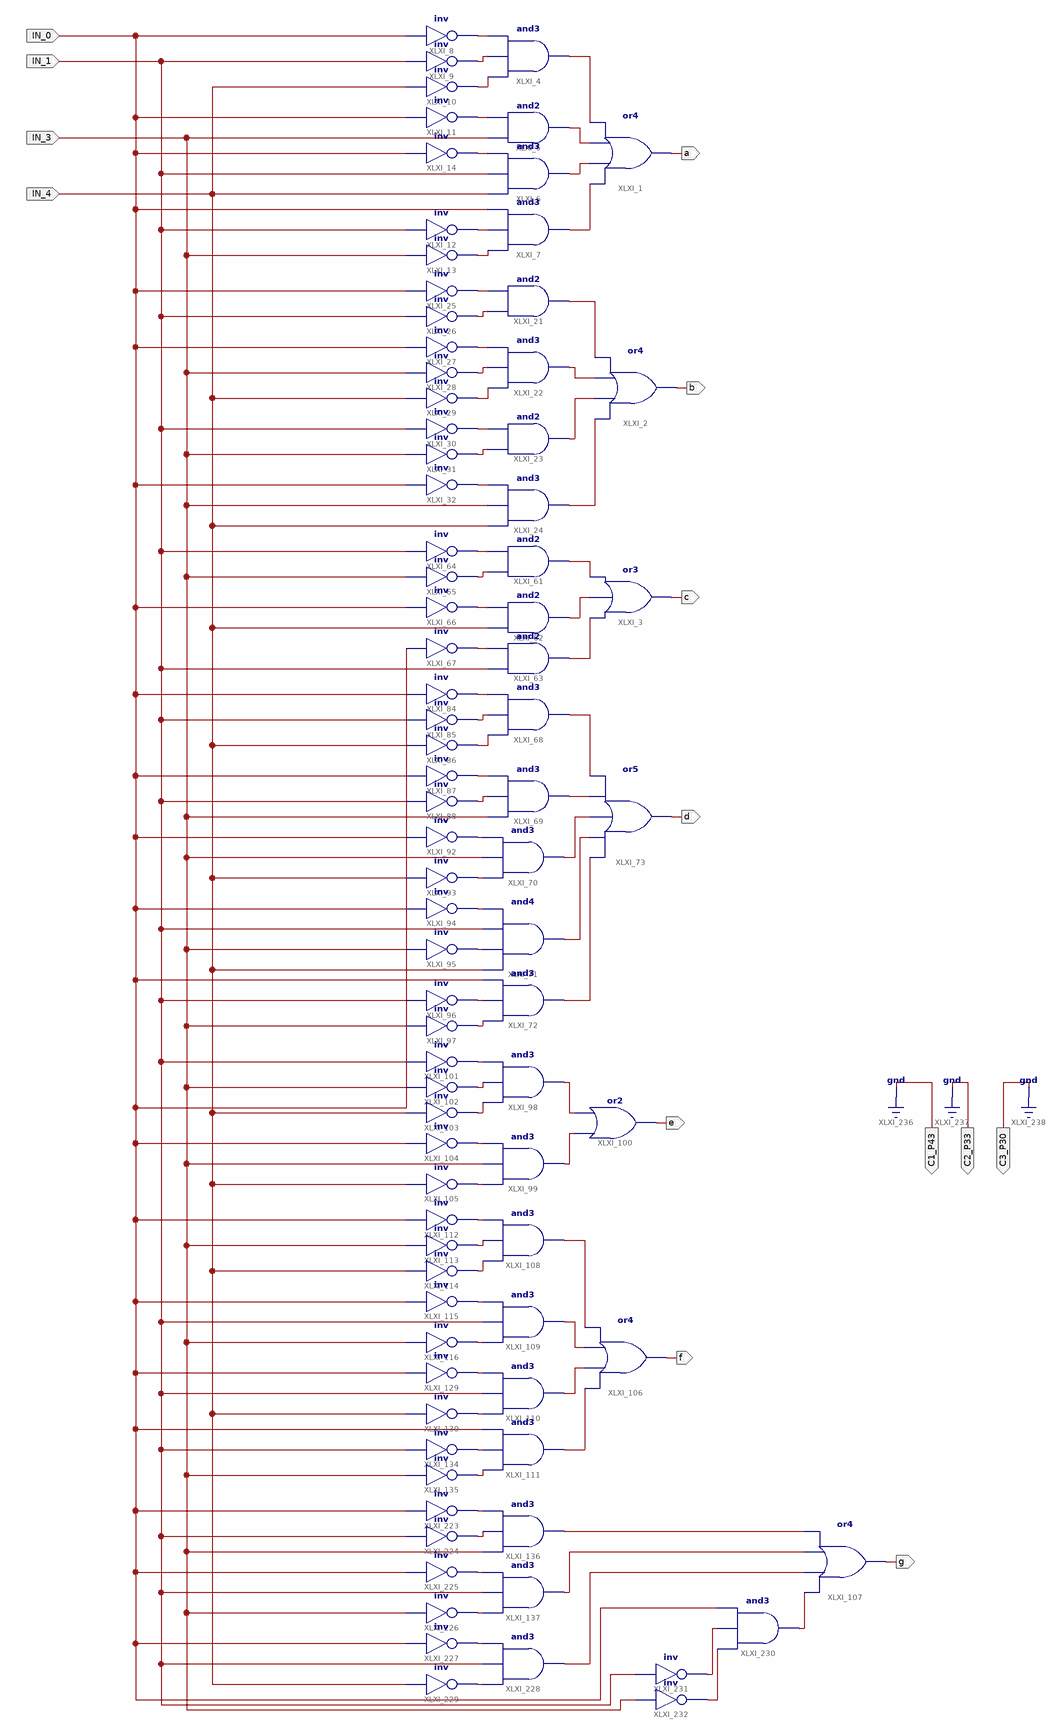
[diagram p0: schematic sheet 1]
// Xilinx ISE schematic counter0_9.sch (spartan6) as structural Verilog: 85 symbols, 14 ports
module counter0_9 (
  input  IN_3,
  input  IN_0,
  input  IN_1,
  input  IN_4,
  output a,
  output b,
  output c,
  output d,
  output e,
  output f,
  output g,
  output C1_P43,
  output C2_P33,
  output C3_P30
);

  wire XLXN_1, XLXN_2, XLXN_3, XLXN_4, XLXN_7, XLXN_8, XLXN_9, XLXN_18, XLXN_19, XLXN_20, XLXN_21, XLXN_23,
       XLXN_24, XLXN_25, XLXN_26, XLXN_27, XLXN_28, XLXN_29, XLXN_30, XLXN_34, XLXN_35, XLXN_36, XLXN_37,
       XLXN_49, XLXN_50, XLXN_51, XLXN_52, XLXN_53, XLXN_54, XLXN_57, XLXN_58, XLXN_59, XLXN_60, XLXN_61,
       XLXN_62, XLXN_63, XLXN_65, XLXN_67, XLXN_71, XLXN_72, XLXN_73, XLXN_74, XLXN_75, XLXN_76, XLXN_77,
       XLXN_81, XLXN_82, XLXN_84, XLXN_85, XLXN_86, XLXN_87, XLXN_88, XLXN_96, XLXN_97, XLXN_99, XLXN_100,
       XLXN_101, XLXN_102, XLXN_103, XLXN_104, XLXN_106, XLXN_107, XLXN_108, XLXN_109, XLXN_110, XLXN_217,
       XLXN_219, XLXN_221, XLXN_222, XLXN_224, XLXN_225, XLXN_227, XLXN_228, XLXN_230, XLXN_231, XLXN_232,
       XLXN_233, XLXN_254;

  or XLXI_107 (g, XLXN_233, XLXN_232, XLXN_231, XLXN_230);
  and XLXI_136 (XLXN_230, IN_3, XLXN_219, XLXN_217);
  and XLXI_137 (XLXN_231, XLXN_222, IN_1, XLXN_221);
  and XLXI_4 (XLXN_18, XLXN_3, XLXN_2, XLXN_1);
  not XLXI_8 (XLXN_1, IN_0);
  not XLXI_9 (XLXN_2, IN_1);
  not XLXI_10 (XLXN_3, IN_4);
  not XLXI_11 (XLXN_4, IN_0);
  and XLXI_5 (XLXN_19, IN_3, XLXN_4);
  and XLXI_6 (XLXN_20, IN_4, IN_1, XLXN_7);
  not XLXI_14 (XLXN_7, IN_0);
  and XLXI_7 (XLXN_21, XLXN_9, XLXN_8, IN_0);
  not XLXI_12 (XLXN_8, IN_1);
  not XLXI_13 (XLXN_9, IN_3);
  or XLXI_1 (a, XLXN_21, XLXN_20, XLXN_19, XLXN_18);
  not XLXI_25 (XLXN_23, IN_0);
  not XLXI_26 (XLXN_24, IN_1);
  not XLXI_27 (XLXN_25, IN_0);
  not XLXI_28 (XLXN_26, IN_3);
  not XLXI_29 (XLXN_27, IN_4);
  not XLXI_30 (XLXN_28, IN_1);
  not XLXI_31 (XLXN_29, IN_3);
  not XLXI_32 (XLXN_30, IN_0);
  and XLXI_22 (XLXN_35, XLXN_27, XLXN_26, XLXN_25);
  and XLXI_23 (XLXN_36, XLXN_29, XLXN_28);
  and XLXI_24 (XLXN_37, IN_4, IN_3, XLXN_30);
  or XLXI_2 (b, XLXN_37, XLXN_36, XLXN_35, XLXN_34);
  and XLXI_21 (XLXN_34, XLXN_24, XLXN_23);
  or XLXI_3 (c, XLXN_54, XLXN_53, XLXN_52);
  and XLXI_61 (XLXN_52, XLXN_50, XLXN_49);
  not XLXI_64 (XLXN_49, IN_1);
  not XLXI_65 (XLXN_50, IN_3);
  not XLXI_66 (XLXN_51, IN_0);
  and XLXI_62 (XLXN_53, IN_4, XLXN_51);
  and XLXI_63 (XLXN_54, IN_1, XLXN_254);
  not XLXI_67 (XLXN_254, IN_0);
  and XLXI_68 (XLXN_73, XLXN_59, XLXN_58, XLXN_57);
  not XLXI_84 (XLXN_57, IN_0);
  not XLXI_85 (XLXN_58, IN_1);
  not XLXI_86 (XLXN_59, IN_4);
  not XLXI_87 (XLXN_60, IN_0);
  not XLXI_88 (XLXN_61, IN_1);
  and XLXI_69 (XLXN_74, IN_3, XLXN_61, XLXN_60);
  and XLXI_70 (XLXN_75, XLXN_63, IN_3, XLXN_62);
  not XLXI_93 (XLXN_63, IN_4);
  not XLXI_92 (XLXN_62, IN_0);
  not XLXI_94 (XLXN_65, IN_0);
  and XLXI_71 (XLXN_76, IN_4, XLXN_67, IN_1, XLXN_65);
  not XLXI_95 (XLXN_67, IN_3);
  and XLXI_72 (XLXN_77, XLXN_72, XLXN_71, IN_0);
  not XLXI_96 (XLXN_71, IN_1);
  not XLXI_97 (XLXN_72, IN_3);
  or XLXI_73 (d, XLXN_77, XLXN_76, XLXN_75, XLXN_74, XLXN_73);
  not XLXI_101 (XLXN_81, IN_1);
  not XLXI_102 (XLXN_84, IN_3);
  not XLXI_103 (XLXN_82, IN_4);
  not XLXI_104 (XLXN_85, IN_0);
  not XLXI_105 (XLXN_86, IN_4);
  and XLXI_99 (XLXN_88, XLXN_86, IN_3, XLXN_85);
  or XLXI_100 (e, XLXN_88, XLXN_87);
  and XLXI_98 (XLXN_87, XLXN_82, XLXN_84, XLXN_81);
  not XLXI_112 (XLXN_103, IN_0);
  not XLXI_113 (XLXN_106, IN_3);
  not XLXI_114 (XLXN_104, IN_4);
  not XLXI_115 (XLXN_102, IN_0);
  and XLXI_109 (XLXN_108, XLXN_101, IN_1, XLXN_102);
  not XLXI_116 (XLXN_101, IN_3);
  not XLXI_129 (XLXN_100, IN_0);
  and XLXI_110 (XLXN_109, XLXN_99, IN_1, XLXN_100);
  not XLXI_130 (XLXN_99, IN_4);
  and XLXI_111 (XLXN_110, XLXN_97, XLXN_96, IN_0);
  not XLXI_134 (XLXN_96, IN_1);
  not XLXI_135 (XLXN_97, IN_3);
  and XLXI_108 (XLXN_107, XLXN_104, XLXN_106, XLXN_103);
  or XLXI_106 (f, XLXN_110, XLXN_109, XLXN_108, XLXN_107);
  not XLXI_223 (XLXN_217, IN_0);
  not XLXI_224 (XLXN_219, IN_1);
  not XLXI_225 (XLXN_221, IN_0);
  not XLXI_226 (XLXN_222, IN_3);
  not XLXI_227 (XLXN_224, IN_0);
  and XLXI_228 (XLXN_232, XLXN_225, IN_1, XLXN_224);
  not XLXI_229 (XLXN_225, IN_4);
  and XLXI_230 (XLXN_233, XLXN_227, XLXN_228, IN_0);
  not XLXI_231 (XLXN_228, IN_1);
  not XLXI_232 (XLXN_227, IN_3);

  assign C1_P43 = 1'b0;
  assign C2_P33 = 1'b0;
  assign C3_P30 = 1'b0;
endmodule
